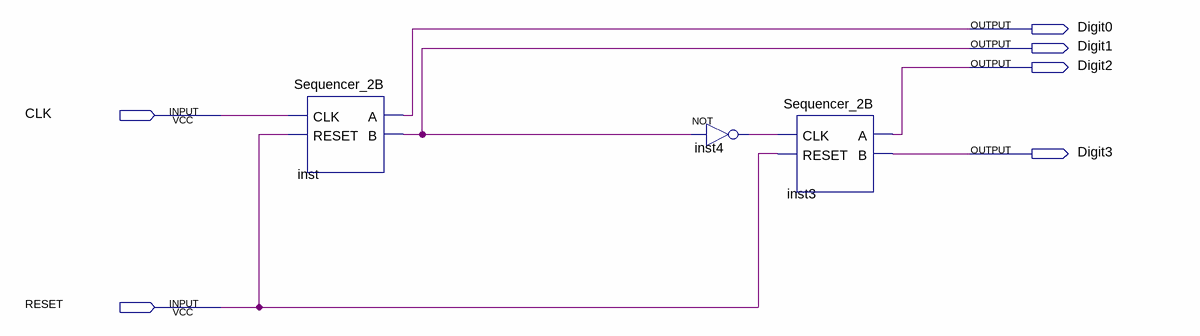
[diagram p0: schematic sheet]
// Quartus schematic counter4bit.bdf as structural Verilog: 3 symbols, 6 pins
module counter4bit (
  input  CLK,
  input  RESET,
  output Digit0,
  output Digit1,
  output Digit2,
  output Digit3
);

  wire inst4_out;

  Sequencer_2B inst (.CLK(CLK), .RESET(RESET), .A(Digit0), .B(Digit1));
  not inst4 (inst4_out, Digit1);
  Sequencer_2B inst3 (.CLK(inst4_out), .RESET(RESET), .A(Digit2), .B(Digit3));
endmodule
